# Altium schematic sheet Power Supply.SchDoc (part 3 of 5)
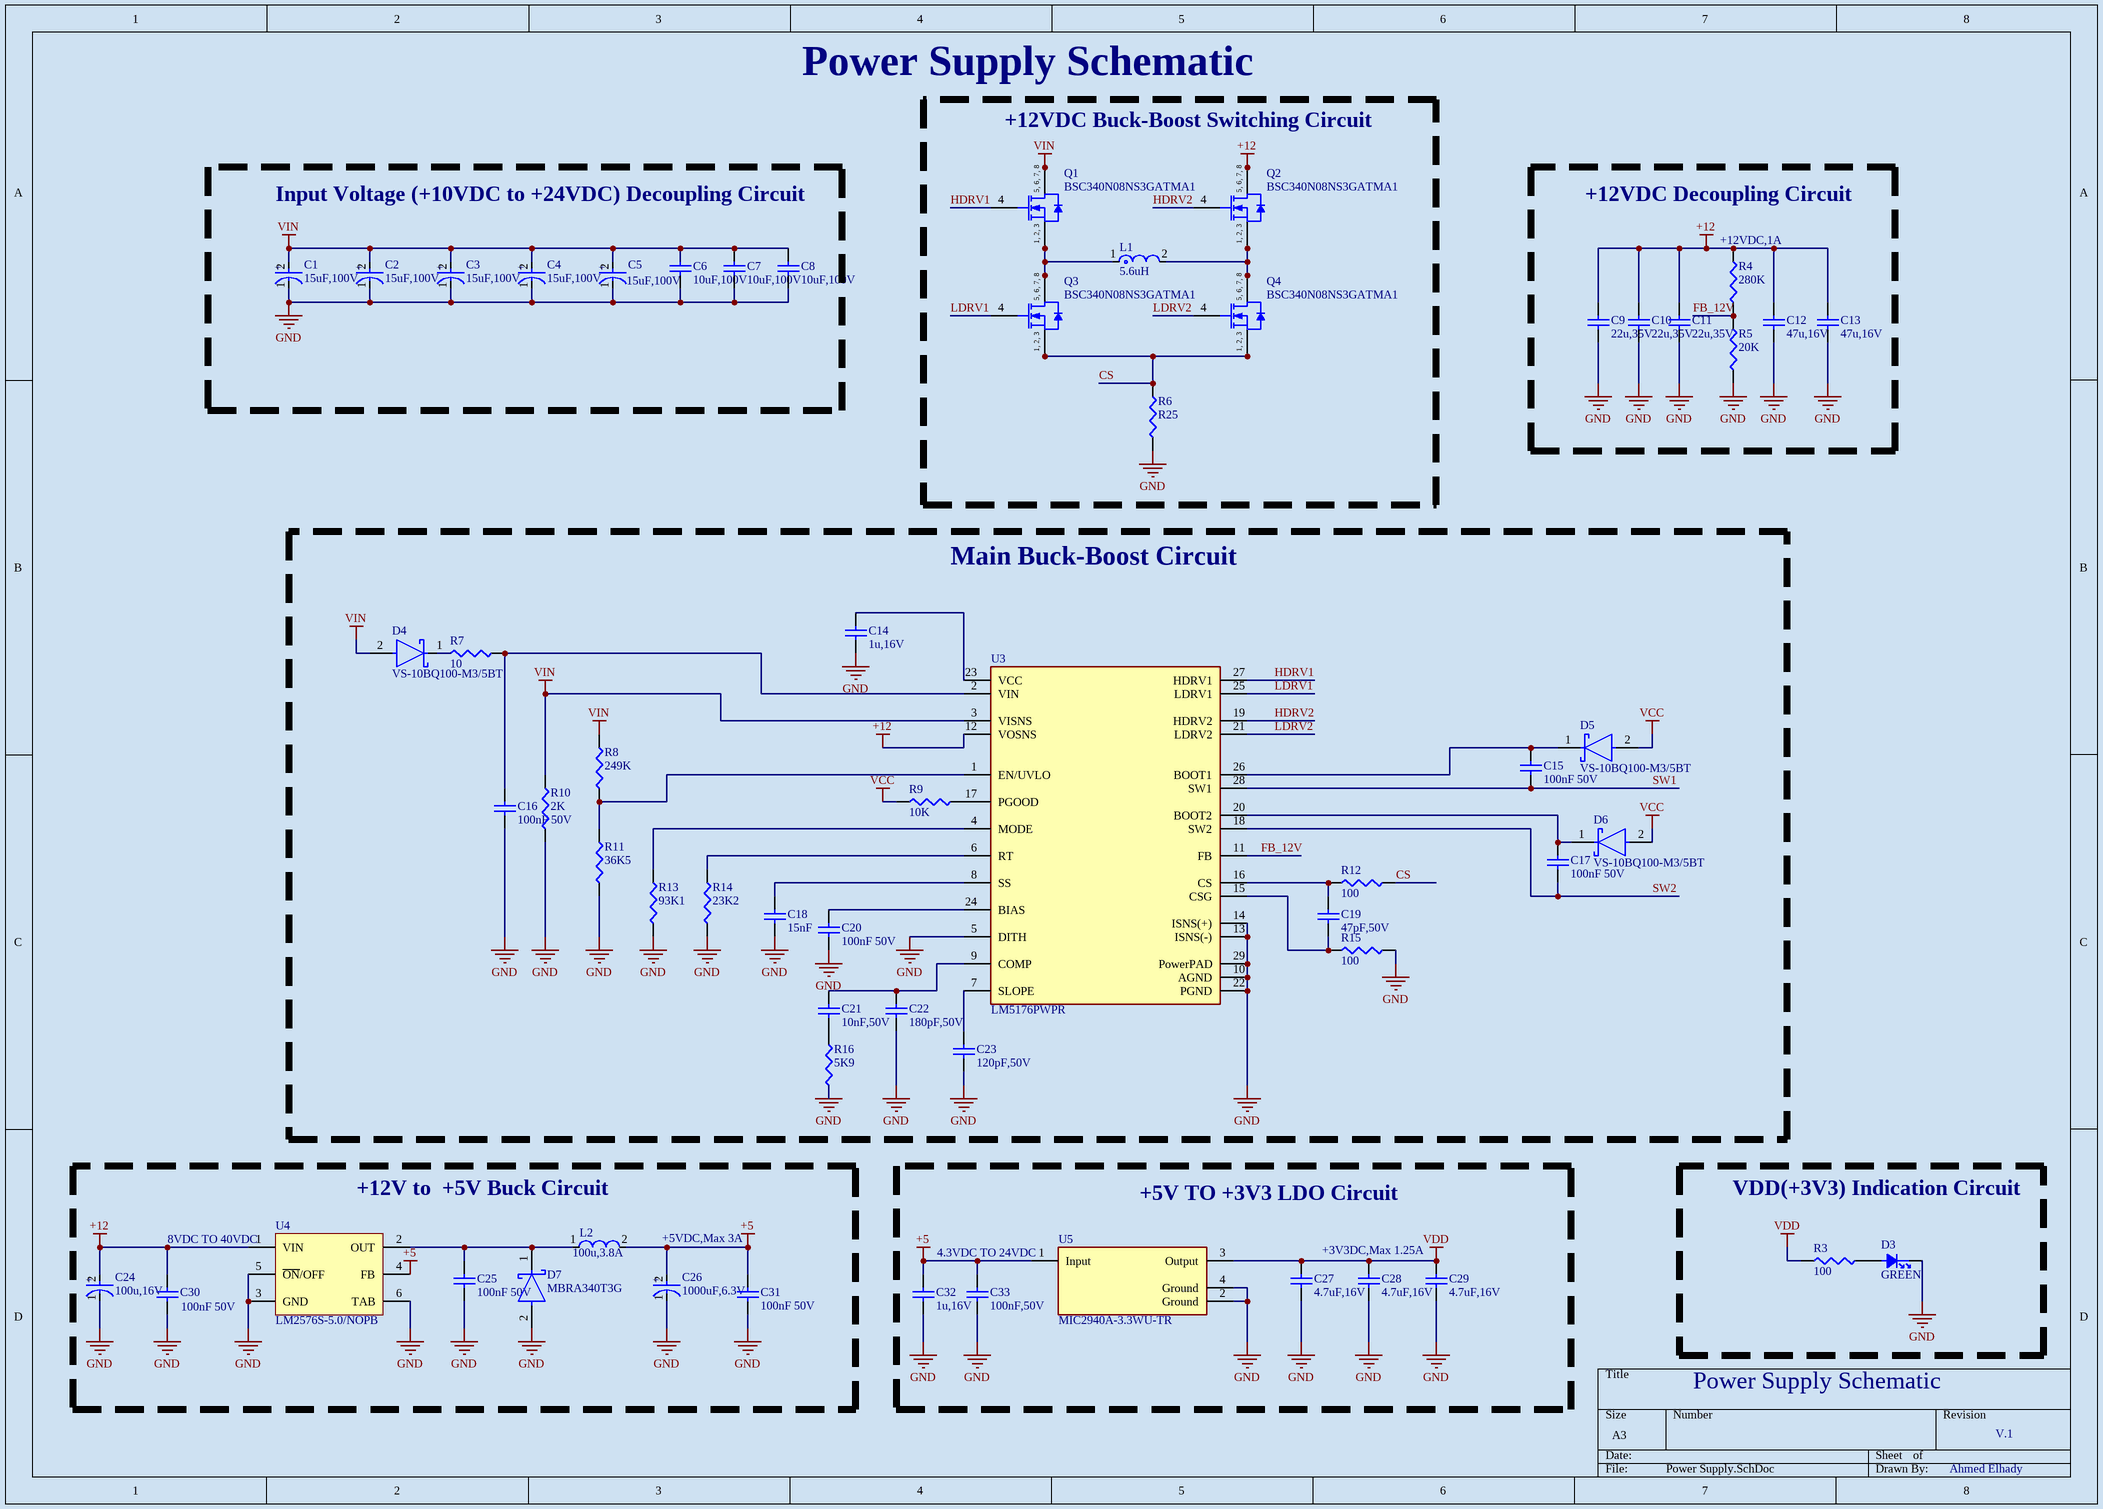
[diagram p2: Power Supply.SchDoc]

## Library data of the parts (continued)
C27-C29 = CL05A475MO5NUNC: 4.7 µF ±20% 16V Ceramic Capacitor X5R 0402 (1005 Metric); Manufacturer: Samsung Electro-Mechanics; Value: 4.7µF; Supplier: DigiKey; Manufacturer Part Number: CL05A475MO5NUNC; RoHS: Compliant; Category: Ceramic Capacitors; Stock: 135039; Pricing: 1=0.12, 10=0.084 (USD); Case/Package: 0402; Case Code (Imperial): 0402; Case Code (Metric): 1005; China RoHS: Compliant; Dielectric: X5R; Dielectric Material: Ceramic; Height: 500µm; Length: 1mm; Lifecycle Status: Production; Material: Ceramic; Max Operating Temperature: 85°C; Min Operating Temperature: -55°C; Mounting Technology: Surface Mount; Number of Terminals: 2; REACH SVHC: Yes; Schedule B: 8532240020, 8532240020|8532240020, 8532240020|8532240020|8532240020, 8532240020|8532240020|8532240020|8532240020; Thickness: 558.8µm; Tolerance: 20%; Voltage Rating: 16V; Voltage Rating (DC): 16V; Width: 500µm; ComponentLink1URL: https://datasheet.octopart.com:443/CL05A475MO5NUNC-Samsung-Electro-Mechanics-datasheet-178175196.pdf?src-supplier=Farnell; ComponentLink1Description: https://datasheet.octopart.com:443/CL05A475MO5NUNC-Samsung-Electro-Mechanics-datasheet-178175196.pdf?src-supplier=Farnell; ComponentLink2URL: https://datasheet.octopart.com:443/CL05A475MO5NUNC-Samsung-Electro-Mechanics-datasheet-123102911.pdf?src-supplier=Future+Electronics; ComponentLink2Description: https://datasheet.octopart.com:443/CL05A475MO5NUNC-Samsung-Electro-Mechanics-datasheet-123102911.pdf?src-supplier=Future+Electronics; ComponentLink3URL: https://datasheet.octopart.com:443/CL05A475MO5NUNC-Samsung-Electro-Mechanics-datasheet-110226225.pdf?src-supplier=Future+Electronics; ComponentLink3Description: https://datasheet.octopart.com:443/CL05A475MO5NUNC-Samsung-Electro-Mechanics-datasheet-110226225.pdf?src-supplier=Future+Electronics; ComponentLink4URL: https://datasheet.octopart.com:443/CL05A475MO5NUNC-Samsung-Electro-Mechanics-datasheet-83567908.pdf?src-supplier=Future+Electronics; ComponentLink4Description: https://datasheet.octopart.com:443/CL05A475MO5NUNC-Samsung-Electro-Mechanics-datasheet-83567908.pdf?src-supplier=Future+Electronics; ComponentLink5URL: https://datasheet.octopart.com:443/CL05A475MO5NUNC-Samsung-Electro-Mechanics-datasheet-68297032.pdf?src-supplier=Future+Electronics; ComponentLink5Description: https://datasheet.octopart.com:443/CL05A475MO5NUNC-Samsung-Electro-Mechanics-datasheet-68297032.pdf?src-supplier=Future+Electronics; ComponentLink6URL: https://datasheet.octopart.com:443/CL05A475MO5NUNC-Samsung-Electro-Mechanics-datasheet-87580057.pdf?src-supplier=Future+Electronics; ComponentLink6Description: https://datasheet.octopart.com:443/CL05A475MO5NUNC-Samsung-Electro-Mechanics-datasheet-87580057.pdf?src-supplier=Future+Electronics; ComponentLink7URL: https://datasheet.octopart.com:443/CL05A475MO5NUNC-Samsung-Electro-Mechanics-datasheet-149136694.pdf?src-supplier=Future+Electronics; ComponentLink7Description: https://datasheet.octopart.com:443/CL05A475MO5NUNC-Samsung-Electro-Mechanics-datasheet-149136694.pdf?src-supplier=Future+Electronics; LCSC Part Number: C318563
D3 = VLMG1500-GS08: Yellow-Green 571nm LED Indication - Discrete 2V 0402 (1005 Metric); Manufacturer: Vishay; Color: Green, Yellow; Forward Current: 30mA; Forward Voltage: 2.4V; Lens Color: Clear; Lens Style: Rectangular; Luminous Intensity: 18mcd; Number of Circuits: 1; Power Dissipation: 75mW; Reverse Voltage: 5V; Test Current: 20mA; Viewing Angle: 130°; Supplier: DigiKey; Manufacturer Part Number: VLMG1500-GS08; RoHS: Compliant; Category: LEDs; Stock: 250894; Pricing: 1=0.24, 10=0.164, 100=0.1147, 500=0.09218, 1000=0.0847 (USD); Ambient Temperature Range High: 85°C; Case/Package: 0402; Case Code (Imperial): 0402; Case Code (Metric): 1005; Depth: 500µm; Dominant Wavelength: 571nm; Height: 350µm; Illumination Color: Green; Lead Free: Lead Free; Length: 1mm; Lifecycle Status: Production; Max Operating Temperature: 85°C; Min Operating Temperature: -30°C; Mounting Technology: Surface Mount; Number of Elements: 1; Number of LEDs: 1; Pins: 2; Number of Terminals: 2; Packaging: Cut Tape; Peak Wavelength: 571nm; Power Rating: 75mW; Radiation Hardening: No; REACH SVHC: Yes; Schedule B: 8541402000, 8541402000|8541402000|8541402000|8541402000|8541402000; Shape: Rectangular; Terminal Pitch: 675µm; Wavelength: 571nm; Width: 500µm; ComponentLink1URL: https://datasheet.octopart.com:443/VLMG1500-GS08-Vishay-datasheet-181477802.pdf?src-supplier=IHS; ComponentLink1Description: https://datasheet.octopart.com:443/VLMG1500-GS08-Vishay-datasheet-181477802.pdf?src-supplier=IHS; ComponentLink2URL: https://datasheet.octopart.com:443/VLMG1500-GS08-Vishay-datasheet-21227148.pdf?src-supplier=element14+APAC; ComponentLink2Description: https://datasheet.octopart.com:443/VLMG1500-GS08-Vishay-datasheet-21227148.pdf?src-supplier=element14+APAC; ComponentLink3URL: https://datasheet.octopart.com:443/VLMG1500-GS08-Vishay-datasheet-33014519.pdf?src-supplier=element14+APAC; ComponentLink3Description: https://datasheet.octopart.com:443/VLMG1500-GS08-Vishay-datasheet-33014519.pdf?src-supplier=element14+APAC; ComponentLink4URL: https://datasheet.octopart.com:443/VLMG1500-GS08-Vishay-datasheet-62332426.pdf?src-supplier=Newark; ComponentLink4Description: https://datasheet.octopart.com:443/VLMG1500-GS08-Vishay-datasheet-62332426.pdf?src-supplier=Newark; ComponentLink5URL: https://datasheet.octopart.com:443/VLMG1500-GS08-Vishay-datasheet-102762782.pdf?src-supplier=Future+Electronics; ComponentLink5Description: https://datasheet.octopart.com:443/VLMG1500-GS08-Vishay-datasheet-102762782.pdf?src-supplier=Future+Electronics; ComponentLink6URL: https://datasheet.octopart.com:443/VLMG1500-GS08-Vishay-datasheet-68326145.pdf?src-supplier=TME; ComponentLink6Description: https://datasheet.octopart.com:443/VLMG1500-GS08-Vishay-datasheet-68326145.pdf?src-supplier=TME; ComponentLink7URL: http://sigma.octopart.com:80/rohs_statement/Vishay-company-15.pdf?src-supplier=Compliance+Statements; ComponentLink7Description: http://sigma.octopart.com:80/rohs_statement/Vishay-company-15.pdf?src-supplier=Compliance+Statements; LCSC Part Number: C511404
D4-D6 = VS-10BQ100-M3/5BT: Rectifier Diode Schottky 100V 1A 2-Pin SMB T/R / DIODE SCHOTTKY 100V 1A SMB; Manufacturer: Vishay; Value: 65pF; Element Configuration: Single; Max Forward Surge Current (Ifsm): 38A; Max Junction Temperature (Tj): 175°C; Number of Elements: 1; Peak Non-Repetitive Surge Current: 780A; Peak Reverse Current: 500µA; Supplier: DigiKey; Manufacturer Part Number: VS-10BQ100-M3/5BT; RoHS: Compliant; Category: Schottky Diodes; Stock: 33815; Pricing: 1=0.38, 10=0.284, 100=0.2258, 500=0.17026, 1000=0.14915 (USD); Average Rectified Current: 1A; Case/Package: SMB; Forward Current: 1A; Height: 2.44mm; Lead Free: Lead Free; Length: 4.7mm; Lifecycle Status: Production; Max Operating Temperature: 175°C; Max Repetitive Reverse Voltage (Vrrm): 100V; Max Reverse Voltage (DC): 100V; Min Operating Temperature: -55°C; Mounting Technology: Surface Mount; Pins: 2; Number of Terminals: 2; REACH SVHC: No; Reverse Standoff Voltage: 100V; Reverse Voltage: 100V; Schedule B: 8541100080, 8541100080|8541100080|8541100080|8541100080|8541100080; Width: 3.8mm; ComponentLink1URL: https://datasheet.octopart.com:443/VS-10BQ100-M3-5BT-Vishay-datasheet-178520333.pdf?src-supplier=Newark; ComponentLink1Description: https://datasheet.octopart.com:443/VS-10BQ100-M3-5BT-Vishay-datasheet-178520333.pdf?src-supplier=Newark; ComponentLink2URL: https://sigma.octopart.com:443/138898532/technical_drawing/Vishay-VS-10BQ100-M3-5BT.pdf?src-supplier=Upverter; ComponentLink2Description: https://sigma.octopart.com:443/138898532/technical_drawing/Vishay-VS-10BQ100-M3-5BT.pdf?src-supplier=Upverter; ComponentLink3URL: https://datasheet.octopart.com:443/VS-10BQ100-M3-5BT-Vishay-datasheet-67698555.pdf?src-supplier=element14+APAC; ComponentLink3Description: https://datasheet.octopart.com:443/VS-10BQ100-M3-5BT-Vishay-datasheet-67698555.pdf?src-supplier=element14+APAC; ComponentLink4URL: https://datasheet.octopart.com:443/VS-10BQ100-M3-5BT-Vishay-datasheet-137894626.pdf?src-supplier=Future+Electronics; ComponentLink4Description: https://datasheet.octopart.com:443/VS-10BQ100-M3-5BT-Vishay-datasheet-137894626.pdf?src-supplier=Future+Electronics; ComponentLink5URL: https://datasheet.octopart.com:443/VS-10BQ100-M3-5BT-Vishay-datasheet-39729334.pdf?src-supplier=Future+Electronics; ComponentLink5Description: https://datasheet.octopart.com:443/VS-10BQ100-M3-5BT-Vishay-datasheet-39729334.pdf?src-supplier=Future+Electronics; ComponentLink6URL: https://datasheet.octopart.com:443/VS-10BQ100-M3-5BT-Vishay-Dale-datasheet-111086972.pdf?src-supplier=RS+(Formerly+Allied+Electronics); ComponentLink6Description: https://datasheet.octopart.com:443/VS-10BQ100-M3-5BT-Vishay-Dale-datasheet-111086972.pdf?src-supplier=RS+(Formerly+Allied+Electronics); ComponentLink7URL: https://datasheet.octopart.com:443/VS-10BQ100-M3-5BT-Vishay-datasheet-42673636.pdf?src-supplier=TME; ComponentLink7Description: https://datasheet.octopart.com:443/VS-10BQ100-M3-5BT-Vishay-datasheet-42673636.pdf?src-supplier=TME; ComponentLink8URL: http://sigma.octopart.com:80/rohs_statement/Vishay-company-15.pdf?src-supplier=Compliance+Statements; ComponentLink8Description: http://sigma.octopart.com:80/rohs_statement/Vishay-company-15.pdf?src-supplier=Compliance+Statements; LCSC PN: C468041
D7 = MBRA340T3G: Diode; Schottky Barrier; Vr 40V; If 3A; Pkg SMA; Vf 0.45V; Tj +150degc; Cs 100A; Ir 15mA; Manufacturer: onsemi; Manufacturer Lifecycle Status: ACTIVE; Element Configuration: Single; Forward Voltage: 450mV; Max Junction Temperature (Tj): 150°C; Number of Elements: 1; Peak Reverse Current: 300µA; Polarity: Standard; Supplier: DigiKey; Manufacturer Part Number: MBRA340T3G; RoHS: Compliant; Category: Schottky Diodes; Stock: 140782; Pricing: 1=0.88, 10=0.548, 100=0.3555, 500=0.2726, 1000=0.24585, 2000=0.22334, 5000=0.19897, 10000=0.1839, 15000=0.17623, 25000=0.168 (USD); Average Rectified Current: 3A; Case/Package: SMA; China RoHS: Non-Compliant; Current Rating: 3A; Forward Current: 3A; Halogen Free: Halogen Free; Height: 2.2mm; Lead Free: Lead Free; Length: 4.32mm; Lifecycle Status: Production; Max Forward Surge Current (Ifsm): 100A; Max Operating Temperature: 150°C; Max Output current: 3A; Max Repetitive Reverse Voltage (Vrrm): 40V; Max Reverse Voltage (DC): 40V; Min Operating Temperature: -55°C; Pins: 2; Number of Terminals: 2; Output Current: 3A; Packaging: Tape and Reel; Peak Non-Repetitive Surge Current: 100A; Radiation Hardening: No; REACH SVHC: No; Reverse Standoff Voltage: 40V; Reverse Voltage: 40V; Schedule B: 8541100080; Voltage Rating (DC): 40V; Width: 2.6mm; ComponentLink1URL: https://datasheet.octopart.com:443/MBRA340T3G-ON-Semiconductor-datasheet-623523.pdf?src-supplier=Master+Electronics; ComponentLink1Description: https://datasheet.octopart.com:443/MBRA340T3G-ON-Semiconductor-datasheet-623523.pdf?src-supplier=Master+Electronics; ComponentLink2URL: https://datasheet.octopart.com:443/MBRA340T3G-ON-Semiconductor-datasheet-141916657.pdf?src-supplier=Upverter; ComponentLink2Description: https://datasheet.octopart.com:443/MBRA340T3G-ON-Semiconductor-datasheet-141916657.pdf?src-supplier=Upverter; ComponentLink3URL: https://datasheet.octopart.com:443/MBRA340T3G-onsemi-datasheet-180961701.pdf?src-supplier=IHS; ComponentLink3Description: https://datasheet.octopart.com:443/MBRA340T3G-onsemi-datasheet-180961701.pdf?src-supplier=IHS; ComponentLink4URL: https://datasheet.octopart.com:443/MBRA340T3G-ON-Semiconductor-datasheet-139011791.pdf?src-supplier=onsemi; ComponentLink4Description: https://datasheet.octopart.com:443/MBRA340T3G-ON-Semiconductor-datasheet-139011791.pdf?src-supplier=onsemi; ComponentLink5URL: https://datasheet.octopart.com:443/MBRA340T3G-ON-Semiconductor-datasheet-21210960.pdf?src-supplier=Newark; ComponentLink5Description: https://datasheet.octopart.com:443/MBRA340T3G-ON-Semiconductor-datasheet-21210960.pdf?src-supplier=Newark; ComponentLink6URL: https://datasheet.octopart.com:443/MBRA340T3G-ON-Semiconductor-datasheet-11724913.pdf?src-supplier=Newark; ComponentLink6Description: https://datasheet.octopart.com:443/MBRA340T3G-ON-Semiconductor-datasheet-11724913.pdf?src-supplier=Newark; ComponentLink7URL: https://datasheet.octopart.com:443/MBRA340T3G.-onsemi-datasheet-184397938.pdf?src-supplier=Newark; ComponentLink7Description: https://datasheet.octopart.com:443/MBRA340T3G.-onsemi-datasheet-184397938.pdf?src-supplier=Newark; ComponentLink8URL: https://datasheet.octopart.com:443/MBRA340T3G-onsemi-datasheet-180967052.pdf?src-supplier=Farnell; ComponentLink8Description: https://datasheet.octopart.com:443/MBRA340T3G-onsemi-datasheet-180967052.pdf?src-supplier=Farnell; ComponentLink9URL: https://datasheet.octopart.com:443/MBRA340T3G-ON-Semiconductor-datasheet-7627526.pdf?src-supplier=Farnell; ComponentLink9Description: https://datasheet.octopart.com:443/MBRA340T3G-ON-Semiconductor-datasheet-7627526.pdf?src-supplier=Farnell; ComponentLink10URL: https://datasheet.octopart.com:443/MBRA340T3G-ON-Semiconductor-datasheet-14054808.pdf?src-supplier=iiiC; ComponentLink10Description: https://datasheet.octopart.com:443/MBRA340T3G-ON-Semiconductor-datasheet-14054808.pdf?src-supplier=iiiC; ComponentLink11URL: https://datasheet.octopart.com:443/MBRA340T3G-ON-Semiconductor-datasheet-9706899.pdf?src-supplier=RS+(Formerly+Allied+Electronics); ComponentLink11Description: https://datasheet.octopart.com:443/MBRA340T3G-ON-Semiconductor-datasheet-9706899.pdf?src-supplier=RS+(Formerly+Allied+Electronics); ComponentLink12URL: http://sigma.octopart.com:80/15540786/rohs_certificate/ON-Semiconductor-MBRA340T3G.pdf?src-supplier=Compliance+Statements; ComponentLink12Description: http://sigma.octopart.com:80/15540786/rohs_certificate/ON-Semiconductor-MBRA340T3G.pdf?src-supplier=Compliance+Statements; ComponentLink13URL: http://sigma.octopart.com:80/15677621/materials_sheet/ON-Semiconductor-MBRA340T3G.csv?src-supplier=Compliance+Statements; ComponentLink13Description: http://sigma.octopart.com:80/15677621/materials_sheet/ON-Semiconductor-MBRA340T3G.csv?src-supplier=Compliance+Statements; ComponentLink14URL: http://sigma.octopart.com:80/150614152/rohs_statement/ON-Semiconductor-MBRA340T3G.pdf?src-supplier=Compliance+Statements; ComponentLink14Description: http://sigma.octopart.com:80/150614152/rohs_statement/ON-Semiconductor-MBRA340T3G.pdf?src-supplier=Compliance+Statements; ComponentLink15URL: http://sigma.octopart.com:80/reach_statement/ON-Semiconductor-company-79.pdf?src-supplier=Compliance+Statements; ComponentLink15Description: http://sigma.octopart.com:80/reach_statement/ON-Semiconductor-company-79.pdf?src-supplier=Compliance+Statements; ComponentLink16URL: https://octopart.com:443/opatz8j6/c1?t=zzn-QeKWnUTIoInBBQPnq2-KsBHceJK6K3Di68oXKNRROh1yObwrhIfgiObG-wqoALwLVjTjSHmYplZjCeWn-q8HVpW_q2F8JFKJqslmK1ptKZFGgWhiNTjCk-X3F1oiCxuNacxFjO0GuM-e28TQqjTQ5gDglIyA9DiWDXs9_UD5t2jlYsyT0X_N6D3As7ewWxw82up4uMZrz57LDgjWgjShyOLNEPJgVYRYhs_nhtEi-aeewe94t8zG-fVSA0SK1baPOhdicFNVV1nRPYknrO_IJ2AVTt3JuNz5Rux_5Ji3UfZsPwlPyX2eF8yjwkYgfgWinTURtYyAI9fkAiCLBUZamGpUFuLxlfvL&src-supplier=Compliance+Statements; ComponentLink16Description: https://octopart.com:443/opatz8j6/c1?t=zzn-QeKWnUTIoInBBQPnq2-KsBHceJK6K3Di68oXKNRROh1yObwrhIfgiObG-wqoALwLVjTjSHmYplZjCeWn-q8HVpW_q2F8JFKJqslmK1ptKZFGgWhiNTjCk-X3F1oiCxuNacxFjO0GuM-e28TQqjTQ5gDglIyA9DiWDXs9_UD5t2jlYsyT0X_N6D3As7ewWxw82up4uMZrz57LDgjWgjShyOLNEPJgVYRYhs_nhtEi-aeewe94t8zG-fVSA0SK1baPOhdicFNVV1nRPYknrO_IJ2AVTt3JuNz5Rux_5Ji3UfZsPwlPyX2eF8yjwkYgfgWinTURtYyAI9fkAiCLBUZamGpUFuLxlfvL&src-supplier=Compliance+Statements; ComponentLink17URL: https://octopart.com:443/opatz8j6/c1?t=NJ8a6hvi7xfiMo7vANJq_qq5CwgiSOMZ50FoGwFbdVP4ZYU8l2yzsihL5d3PYwPSnveb6yOwPbFEklAt98_r0GPlS3SH0en-PzaQ4UJ87X-8SUKCS_jgwdOPTTlwC48N3JBxqteYaPYTYi_MWY_tr-8i0sZ6qVdPF2LoDUWuM_HCXvNlLxr-CuaxZkYPpSF7SojnQnnv5iJsrRNMU3w9C2QjPL7Dn52RqoX7ulzDwYIbX4FC71ya5r_8oyAS221O1yOsg23BvQOD9XPEKD_2ywml0mHj-wzm5xxtgYeWvmyBCaeMd406MBzdLevzYMOAcnTG_zam_3et1Hn15cynFImq-tcBB7RajZQ4FQ&src-supplier=Compliance+Statements; ComponentLink17Description: https://octopart.com:443/opatz8j6/c1?t=NJ8a6hvi7xfiMo7vANJq_qq5CwgiSOMZ50FoGwFbdVP4ZYU8l2yzsihL5d3PYwPSnveb6yOwPbFEklAt98_r0GPlS3SH0en-PzaQ4UJ87X-8SUKCS_jgwdOPTTlwC48N3JBxqteYaPYTYi_MWY_tr-8i0sZ6qVdPF2LoDUWuM_HCXvNlLxr-CuaxZkYPpSF7SojnQnnv5iJsrRNMU3w9C2QjPL7Dn52RqoX7ulzDwYIbX4FC71ya5r_8oyAS221O1yOsg23BvQOD9XPEKD_2ywml0mHj-wzm5xxtgYeWvmyBCaeMd406MBzdLevzYMOAcnTG_zam_3et1Hn15cynFImq-tcBB7RajZQ4FQ&src-supplier=Compliance+Statements; LCSC PN: C26178
L1 = XAL5050-562MEC: 5.6 µH Shielded Molded Inductor 7.2 A 25.8mOhm Max Nonstandard; Manufacturer: Coilcraft; Core Material: Composite; DC Resistance (DCR): 25.8mΩ; Value: 5.6µH; Max Current Rating: 7.2A; Number of Circuits: 1; Self Resonant Frequency: 25MHz; Shielding: Yes; Test Frequency: 1MHz; Tolerance: 20%; Supplier: DigiKey Marketplace; Manufacturer Part Number: XAL5050-562MEC; RoHS: Compliant; Category: Fixed Inductors; Stock: 4733; Pricing: 1=4.11, 100=3.6, 250=2.715, 500=1.635 (USD); Height: 5.1mm; Lead Free: Contains Lead; Length: 5.68mm; Lifecycle Status: Production; Max DC Current: 7.2A; Max Operating Temperature: 125°C; Min Operating Temperature: -40°C; Number of Terminals: 2; REACH SVHC: Yes; Termination: SMD/SMT; Width: 5.28mm; ComponentLink1URL: https://datasheet.octopart.com:443/XAL5050-562MEC-Coilcraft-datasheet-180122023.pdf?src-supplier=IHS; ComponentLink1Description: https://datasheet.octopart.com:443/XAL5050-562MEC-Coilcraft-datasheet-180122023.pdf?src-supplier=IHS; ComponentLink2URL: https://datasheet.octopart.com:443/XAL5050-562MEC-Coilcraft-datasheet-10792017.pdf?src-supplier=Coilcraft+Direct; ComponentLink2Description: https://datasheet.octopart.com:443/XAL5050-562MEC-Coilcraft-datasheet-10792017.pdf?src-supplier=Coilcraft+Direct; LCSC PN: C7305309
L2 = AMDLA1306Q-101MT: 100 µH Shielded Molded Inductor 3.8 A 161mOhm Max Nonstandard; Manufacturer: Abracon; DC Resistance (DCR): 161mΩ; Value: 100µH; Number of Circuits: 1; Shielding: Yes; Test Frequency: 100kHz; Tolerance: 20%; Supplier: DigiKey; Manufacturer Part Number: AMDLA1306Q-101MT; RoHS: Compliant; Category: Fixed Inductors; Pricing: 500=0.69478 (USD); Height: 6.2mm; Lifecycle Status: Production; Max Current Rating: 3.8A; Max Operating Temperature: 155°C; Min Operating Temperature: -55°C; Number of Terminals: 2; REACH SVHC: Yes; Width: 12.6mm; ComponentLink1URL: https://datasheet.octopart.com:443/AMDLA1306Q-101MT-Abracon-datasheet-182205435.pdf?src-supplier=IHS; ComponentLink1Description: https://datasheet.octopart.com:443/AMDLA1306Q-101MT-Abracon-datasheet-182205435.pdf?src-supplier=IHS; ComponentLink2URL: http://sigma.octopart.com:80/conflict_mineral_statement/Abracon-company-27.pdf?src-supplier=Compliance+Statements; ComponentLink2Description: http://sigma.octopart.com:80/conflict_mineral_statement/Abracon-company-27.pdf?src-supplier=Compliance+Statements; LCSC PN: C1016338
Q1-Q4 = BSC340N08NS3GATMA1: N-Channel 80 V 7A (Ta), 23A (Tc) 2.5W (Ta), 32W (Tc) Surface Mount PG-TDSON-8-5; Manufacturer: Infineon; Drain to Source Resistance: 34mΩ; Drain to Source Voltage (Vdss): 80V; Fall Time: 2ns; Gate to Source Voltage (Vgs): 20V; Input Capacitance: 564pF; Number of Elements: 1; Rise Time: 3ns; Turn-Off Delay Time: 11ns; Turn-On Delay Time: 8ns; Supplier: DigiKey; Manufacturer Part Number: BSC340N08NS3GATMA1; RoHS: Compliant; Category: MOSFETs; Stock: 65358; Pricing: 1=0.78, 10=0.632, 100=0.4682, 500=0.41688, 1000=0.35938, 2000=0.34976 (USD); China RoHS: Compliant; Continuous Drain Current (ID): 7A; Halogen Free: Halogen Free; Lead Free: Contains Lead; Lifecycle Status: Production; Max Dual Supply Voltage: 80V; Max Operating Temperature: 150°C; Max Power Dissipation: 32W; Min Breakdown Voltage: 80V; Min Operating Temperature: -55°C; Mounting Technology: Surface Mount; Pins: 8; Number of Terminals: 8; On-State Resistance: 34mΩ; Package Quantity: 5000; Packaging: Tape & Reel; Power Dissipation: 32W; Radiation Hardening: No; Rds On Max: 34mΩ; REACH SVHC: No; Schedule B: 8541290080, 8541290080|8541290080|8541290080|8541290080|8541290080; ComponentLink1URL: https://datasheet.octopart.com:443/BSC340N08NS3GATMA1-Infineon-datasheet-11791424.pdf?src-supplier=IHS; ComponentLink1Description: https://datasheet.octopart.com:443/BSC340N08NS3GATMA1-Infineon-datasheet-11791424.pdf?src-supplier=IHS; ComponentLink2URL: https://datasheet.octopart.com:443/BSC340N08NS3-G-Infineon-datasheet-10738940.pdf?src-supplier=iiiC; ComponentLink2Description: https://datasheet.octopart.com:443/BSC340N08NS3-G-Infineon-datasheet-10738940.pdf?src-supplier=iiiC; ComponentLink3URL: http://sigma.octopart.com:80/conflict_mineral_statement/Infineon-company-51.pdf?src-supplier=Compliance+Statements; ComponentLink3Description: http://sigma.octopart.com:80/conflict_mineral_statement/Infineon-company-51.pdf?src-supplier=Compliance+Statements; LCSC PN: C83511
R3 R12 R15 = CRCW0603100RFKEA: 100 Ohms ±1% 0.125W, 1/8W Chip Resistor 0603 (1608 Metric) Automotive AEC-Q200 Thick Film; Manufacturer: Vishay; Max Power Dissipation: 100mW; Value: 100Ω; Temperature Coefficient: 100ppm/°C; Voltage Rating: 75V; Supplier: DigiKey; Manufacturer Part Number: CRCW0603100RFKEA; RoHS: Compliant; Category: Chip SMD Resistors; Stock: 486492; Pricing: 1=0.1, 10=0.03, 25=0.0224, 50=0.0182, 100=0.015, 250=0.01172, 500=0.0099, 1000=0.00845 (USD); Case/Package: 0603; Case Code (Imperial): 0603; China RoHS: Non-Compliant; Composition: Thick Film; Contact Plating: Tin; Depth: 850µm; Features: Automotive AEC-Q200; Height: 450µm; Lead Free: Lead Free; Length: 1.55mm; Lifecycle Status: Production; Max Operating Temperature: 155°C; Military Standard: Not; Min Operating Temperature: -55°C; Mounting Technology: Surface Mount; Pins: 2; Number of Terminals: 2; Number of Terminations: 2; Packaging: Cut Tape; Power Dissipation: 100mW; Power Rating: 100mW; Radiation Hardening: No; REACH SVHC: Yes; Schedule B: 8533210045; Termination: SMD/SMT; Tolerance: 1%; Voltage Rating (DC): 75V; Weight: 2.012816mg; Width: 850µm; Working Voltage: 75V; ComponentLink1URL: https://datasheet.octopart.com:443/CRCW0603100RFKEA-Vishay-datasheet-175423584.pdf?src-supplier=Newark; ComponentLink1Description: https://datasheet.octopart.com:443/CRCW0603100RFKEA-Vishay-datasheet-175423584.pdf?src-supplier=Newark; ComponentLink2URL: https://datasheet.octopart.com:443/CRCW0603100RFKEA-Vishay-datasheet-14722531.pdf?src-supplier=Newark; ComponentLink2Description: https://datasheet.octopart.com:443/CRCW0603100RFKEA-Vishay-datasheet-14722531.pdf?src-supplier=Newark; ComponentLink3URL: https://datasheet.octopart.com:443/CRCW0603100RFKEA-Vishay-datasheet-11516975.pdf?src-supplier=Newark; ComponentLink3Description: https://datasheet.octopart.com:443/CRCW0603100RFKEA-Vishay-datasheet-11516975.pdf?src-supplier=Newark; ComponentLink4URL: https://datasheet.octopart.com:443/CRCW0603100RFKEA-Vishay-datasheet-41302739.pdf?src-supplier=Newark; ComponentLink4Description: https://datasheet.octopart.com:443/CRCW0603100RFKEA-Vishay-datasheet-41302739.pdf?src-supplier=Newark; ComponentLink5URL: https://datasheet.octopart.com:443/CRCW0603100RFKEA-Vishay-datasheet-33013972.pdf?src-supplier=Newark; ComponentLink5Description: https://datasheet.octopart.com:443/CRCW0603100RFKEA-Vishay-datasheet-33013972.pdf?src-supplier=Newark; ComponentLink6URL: https://datasheet.octopart.com:443/CRCW0603100RFKEA-Vishay-datasheet-21226360.pdf?src-supplier=Newark; ComponentLink6Description: https://datasheet.octopart.com:443/CRCW0603100RFKEA-Vishay-datasheet-21226360.pdf?src-supplier=Newark; ComponentLink7URL: https://datasheet.octopart.com:443/CRCW0603100RFKEA-Vishay-datasheet-62316122.pdf?src-supplier=Future+Electronics; ComponentLink7Description: https://datasheet.octopart.com:443/CRCW0603100RFKEA-Vishay-datasheet-62316122.pdf?src-supplier=Future+Electronics; ComponentLink8URL: https://datasheet.octopart.com:443/CRCW0603100RFKEA-Vishay-datasheet-5300368.pdf?src-supplier=Future+Electronics; ComponentLink8Description: https://datasheet.octopart.com:443/CRCW0603100RFKEA-Vishay-datasheet-5300368.pdf?src-supplier=Future+Electronics; ComponentLink9URL: https://datasheet.octopart.com:443/CRCW0603100RFKEA-Vishay-datasheet-83961561.pdf?src-supplier=element14+APAC; ComponentLink9Description: https://datasheet.octopart.com:443/CRCW0603100RFKEA-Vishay-datasheet-83961561.pdf?src-supplier=element14+APAC; ComponentLink10URL: https://datasheet.octopart.com:443/CRCW0603100RFKEA-Vishay-datasheet-62317933.pdf?src-supplier=element14+APAC; ComponentLink10Description: https://datasheet.octopart.com:443/CRCW0603100RFKEA-Vishay-datasheet-62317933.pdf?src-supplier=element14+APAC; ComponentLink11URL: https://datasheet.octopart.com:443/CRCW0603100RFKEA-Vishay-datasheet-16179825.pdf?src-supplier=element14+APAC; ComponentLink11Description: https://datasheet.octopart.com:443/CRCW0603100RFKEA-Vishay-datasheet-16179825.pdf?src-supplier=element14+APAC; ComponentLink12URL: https://datasheet.octopart.com:443/CRCW0603100RFKEA-Vishay-datasheet-66077789.pdf?src-supplier=element14+APAC; ComponentLink12Description: https://datasheet.octopart.com:443/CRCW0603100RFKEA-Vishay-datasheet-66077789.pdf?src-supplier=element14+APAC; ComponentLink13URL: https://datasheet.octopart.com:443/CRCW0603100RFKEA-Vishay-datasheet-5306405.pdf?src-supplier=RS+(Formerly+Allied+Electronics); ComponentLink13Description: https://datasheet.octopart.com:443/CRCW0603100RFKEA-Vishay-datasheet-5306405.pdf?src-supplier=RS+(Formerly+Allied+Electronics); ComponentLink14URL: https://datasheet.octopart.com:443/CRCW0603100RFKEA-Vishay-Dale-datasheet-47688880.pdf?src-supplier=RS+(Formerly+Allied+Electronics); ComponentLink14Description: https://datasheet.octopart.com:443/CRCW0603100RFKEA-Vishay-Dale-datasheet-47688880.pdf?src-supplier=RS+(Formerly+Allied+Electronics); ComponentLink15URL: https://datasheet.octopart.com:443/CRCW0603100RFKEA-Vishay-datasheet-12001583.pdf?src-supplier=RS+(Formerly+Allied+Electronics); ComponentLink15Description: https://datasheet.octopart.com:443/CRCW0603100RFKEA-Vishay-datasheet-12001583.pdf?src-supplier=RS+(Formerly+Allied+Electronics); ComponentLink16URL: https://datasheet.octopart.com:443/CRCW0603100RFKEA-Vishay-datasheet-137113732.pdf?src-supplier=X-ON; ComponentLink16Description: https://datasheet.octopart.com:443/CRCW0603100RFKEA-Vishay-datasheet-137113732.pdf?src-supplier=X-ON; ComponentLink17URL: https://datasheet.octopart.com:443/CRCW0603100RFKEA-Vishay-datasheet-17834126.pdf?src-supplier=TME; ComponentLink17Description: https://datasheet.octopart.com:443/CRCW0603100RFKEA-Vishay-datasheet-17834126.pdf?src-supplier=TME; ComponentLink18URL: https://datasheet.octopart.com/D-CRCW-e3-Standard-Thick-Film-Chip-Resistors-Vishay-datasheet-family-64.pdf; ComponentLink18Description: https://datasheet.octopart.com/D-CRCW-e3-Standard-Thick-Film-Chip-Resistors-Vishay-datasheet-family-64.pdf; ComponentLink19URL: https://datasheet.octopart.com:443/CRCW0603100RFKEA-Vishay-datasheet-13242068.pdf?src-supplier=Farnell; ComponentLink19Description: https://datasheet.octopart.com:443/CRCW0603100RFKEA-Vishay-datasheet-13242068.pdf?src-supplier=Farnell; ComponentLink20URL: https://datasheet.octopart.com:443/CRCW0603100RFKEA-Vishay-datasheet-13195083.pdf?src-supplier=Farnell; ComponentLink20Description: https://datasheet.octopart.com:443/CRCW0603100RFKEA-Vishay-datasheet-13195083.pdf?src-supplier=Farnell; ComponentLink21URL: https://datasheet.octopart.com:443/CRCW0603100RFKEA-Vishay-datasheet-13034211.pdf?src-supplier=Farnell; ComponentLink21Description: https://datasheet.octopart.com:443/CRCW0603100RFKEA-Vishay-datasheet-13034211.pdf?src-supplier=Farnell; ComponentLink22URL: https://datasheet.octopart.com:443/CRCW0603100RFKEA-Vishay-datasheet-12600034.pdf?src-supplier=Farnell; ComponentLink22Description: https://datasheet.octopart.com:443/CRCW0603100RFKEA-Vishay-datasheet-12600034.pdf?src-supplier=Farnell; ComponentLink23URL: https://datasheet.octopart.com:443/CRCW0603100RFKEA-Vishay-datasheet-12532161.pdf?src-supplier=Farnell; ComponentLink23Description: https://datasheet.octopart.com:443/CRCW0603100RFKEA-Vishay-datasheet-12532161.pdf?src-supplier=Farnell; ComponentLink24URL: https://datasheet.octopart.com:443/CRCW0603100RFKEA-Vishay-datasheet-12517896.pdf?src-supplier=Farnell; ComponentLink24Description: https://datasheet.octopart.com:443/CRCW0603100RFKEA-Vishay-datasheet-12517896.pdf?src-supplier=Farnell; ComponentLink25URL: https://datasheet.octopart.com:443/CRCW0603100RFKEA-Vishay-datasheet-12509762.pdf?src-supplier=Farnell; ComponentLink25Description: https://datasheet.octopart.com:443/CRCW0603100RFKEA-Vishay-datasheet-12509762.pdf?src-supplier=Farnell; ComponentLink26URL: https://datasheet.octopart.com:443/CRCW0603100RFKEA-Vishay-datasheet-10322335.pdf?src-supplier=Farnell; ComponentLink26Description: https://datasheet.octopart.com:443/CRCW0603100RFKEA-Vishay-datasheet-10322335.pdf?src-supplier=Farnell; ComponentLink27URL: https://datasheet.octopart.com:443/CRCW0603100RFKEA-Vishay-datasheet-8788789.pdf?src-supplier=Farnell; ComponentLink27Description: https://datasheet.octopart.com:443/CRCW0603100RFKEA-Vishay-datasheet-8788789.pdf?src-supplier=Farnell; ComponentLink28URL: https://datasheet.octopart.com:443/CRCW0603100RFKEA-Vishay-datasheet-8361388.pdf?src-supplier=Farnell; ComponentLink28Description: https://datasheet.octopart.com:443/CRCW0603100RFKEA-Vishay-datasheet-8361388.pdf?src-supplier=Farnell; ComponentLink29URL: https://datasheet.octopart.com:443/CRCW0603100RFKEA-Vishay-datasheet-546287.pdf?src-supplier=Farnell; ComponentLink29Description: https://datasheet.octopart.com:443/CRCW0603100RFKEA-Vishay-datasheet-546287.pdf?src-supplier=Farnell; ComponentLink30URL: https://datasheet.octopart.com:443/CRCW0603100RFKEA-Vishay-datasheet-11540273.pdf?src-supplier=Arrow+Electronics; ComponentLink30Description: https://datasheet.octopart.com:443/CRCW0603100RFKEA-Vishay-datasheet-11540273.pdf?src-supplier=Arrow+Electronics; ComponentLink31URL: https://datasheet.octopart.com:443/CRCW0603100RFKEA-Vishay-datasheet-8445837.pdf?src-supplier=element14; ComponentLink31Description: https://datasheet.octopart.com:443/CRCW0603100RFKEA-Vishay-datasheet-8445837.pdf?src-supplier=element14; ComponentLink32URL: https://datasheet.octopart.com:443/CRCW0603100RFKEA-Vishay-datasheet-5377433.pdf?src-supplier=Garrett; ComponentLink32Description: https://datasheet.octopart.com:443/CRCW0603100RFKEA-Vishay-datasheet-5377433.pdf?src-supplier=Garrett; ComponentLink33URL: https://datasheet.octopart.com:443/CRCW0603100RFKEA-Vishay-datasheet-148188.pdf?src-supplier=Garrett; ComponentLink33Description: https://datasheet.octopart.com:443/CRCW0603100RFKEA-Vishay-datasheet-148188.pdf?src-supplier=Garrett; ComponentLink34URL: https://datasheet.octopart.com:443/CRCW0603100RFKEA-Vishay-datasheet-30224.pdf?src-supplier=Garrett; ComponentLink34Description: https://datasheet.octopart.com:443/CRCW0603100RFKEA-Vishay-datasheet-30224.pdf?src-supplier=Garrett; ComponentLink35URL: http://sigma.octopart.com:80/rohs_certificate/D-CRCW-e3-Standard-Thick-Film-Chip-Resistors-Vishay-family-102.pdf?src-supplier=Compliance+Statements; ComponentLink35Description: http://sigma.octopart.com:80/rohs_certificate/D-CRCW-e3-Standard-Thick-Film-Chip-Resistors-Vishay-family-102.pdf?src-supplier=Compliance+Statements; LCSC PN: C844917
R4 = CRCW0603280KFKEA: 280 kOhms ±1% 0.125W, 1/8W Chip Resistor 0603 (1608 Metric) Automotive AEC-Q200 Thick Film; Manufacturer: Vishay; Max Power Dissipation: 100mW; Value: 280kΩ; Temperature Coefficient: 100ppm/°C; Voltage Rating: 75V; Supplier: DigiKey; Manufacturer Part Number: CRCW0603280KFKEA; RoHS: Compliant; Category: Chip SMD Resistors; Pricing: 1=0.1, 10=0.03, 25=0.0224, 50=0.0182, 100=0.015, 250=0.01172, 500=0.0099, 1000=0.00845 (USD); Case/Package: 0603; Case Code (Imperial): 0603; China RoHS: Non-Compliant; Composition: Thick Film; Contact Plating: Tin; Depth: 850µm; Features: Automotive AEC-Q200; Height: 450µm; Lead Free: Lead Free; Length: 1.55mm; Lifecycle Status: Production; Max Operating Temperature: 155°C; Military Standard: Not; Min Operating Temperature: -55°C; Mounting Technology: Surface Mount; Pins: 2; Number of Terminals: 2; Number of Terminations: 2; Packaging: Cut Tape; Power Dissipation: 100mW; Power Rating: 100mW; Radiation Hardening: No; REACH SVHC: Yes; Schedule B: 8533210045, 8533210045|8533210045|8533210045|8533210045|8533210045|8533210045|8533210045|8533210045|8533210045|8533210045|8533210045|8533210045|8533210045|8533210045|8533210045|8533210045|8533210045|8533210045|8533210045|8533210045|8533210045|8533210045|8533210045|85; Termination: SMD/SMT; Tolerance: 1%; Voltage Rating (DC): 75V; Weight: 2.012816mg; Width: 850µm; Working Voltage: 75V; ComponentLink1URL: https://datasheet.octopart.com:443/CRCW0603280KFKEA-Vishay-datasheet-175423584.pdf?src-supplier=IHS; ComponentLink1Description: https://datasheet.octopart.com:443/CRCW0603280KFKEA-Vishay-datasheet-175423584.pdf?src-supplier=IHS; ComponentLink2URL: https://datasheet.octopart.com:443/CRCW0603280KFKEA-Vishay-datasheet-62316122.pdf?src-supplier=Future+Electronics; ComponentLink2Description: https://datasheet.octopart.com:443/CRCW0603280KFKEA-Vishay-datasheet-62316122.pdf?src-supplier=Future+Electronics; ComponentLink3URL: https://datasheet.octopart.com:443/CRCW0603280KFKEA-Vishay-datasheet-12519820.pdf?src-supplier=Future+Electronics; ComponentLink3Description: https://datasheet.octopart.com:443/CRCW0603280KFKEA-Vishay-datasheet-12519820.pdf?src-supplier=Future+Electronics; ComponentLink4URL: https://datasheet.octopart.com:443/CRCW0603280KFKEA-Vishay-datasheet-190005712.pdf?src-supplier=TME; ComponentLink4Description: https://datasheet.octopart.com:443/CRCW0603280KFKEA-Vishay-datasheet-190005712.pdf?src-supplier=TME; ComponentLink5URL: https://datasheet.octopart.com:443/CRCW0603280KFKEA-Vishay-datasheet-83961561.pdf?src-supplier=Newark; ComponentLink5Description: https://datasheet.octopart.com:443/CRCW0603280KFKEA-Vishay-datasheet-83961561.pdf?src-supplier=Newark; ComponentLink6URL: https://datasheet.octopart.com:443/CRCW0603280KFKEA-Vishay-datasheet-11516975.pdf?src-supplier=Newark; ComponentLink6Description: https://datasheet.octopart.com:443/CRCW0603280KFKEA-Vishay-datasheet-11516975.pdf?src-supplier=Newark; ComponentLink7URL: https://datasheet.octopart.com:443/CRCW0603280KFKEA-Vishay-datasheet-33013972.pdf?src-supplier=Newark; ComponentLink7Description: https://datasheet.octopart.com:443/CRCW0603280KFKEA-Vishay-datasheet-33013972.pdf?src-supplier=Newark; ComponentLink8URL: https://datasheet.octopart.com:443/CRCW0603280KFKEA-Vishay-datasheet-21268114.pdf?src-supplier=Newark; ComponentLink8Description: https://datasheet.octopart.com:443/CRCW0603280KFKEA-Vishay-datasheet-21268114.pdf?src-supplier=Newark; ComponentLink9URL: https://datasheet.octopart.com:443/CRCW0603280KFKEA-Vishay-datasheet-21226360.pdf?src-supplier=Newark; ComponentLink9Description: https://datasheet.octopart.com:443/CRCW0603280KFKEA-Vishay-datasheet-21226360.pdf?src-supplier=Newark; ComponentLink10URL: https://datasheet.octopart.com:443/CRCW0603280KFKEA-Vishay-datasheet-66077789.pdf?src-supplier=element14+APAC; ComponentLink10Description: https://datasheet.octopart.com:443/CRCW0603280KFKEA-Vishay-datasheet-66077789.pdf?src-supplier=element14+APAC; ComponentLink11URL: https://datasheet.octopart.com:443/CRCW0603280KFKEA-Vishay-datasheet-62317936.pdf?src-supplier=element14+APAC; ComponentLink11Description: https://datasheet.octopart.com:443/CRCW0603280KFKEA-Vishay-datasheet-62317936.pdf?src-supplier=element14+APAC; ComponentLink12URL: https://datasheet.octopart.com:443/CRCW0603280KFKEA-Vishay-datasheet-14722531.pdf?src-supplier=element14+APAC; ComponentLink12Description: https://datasheet.octopart.com:443/CRCW0603280KFKEA-Vishay-datasheet-14722531.pdf?src-supplier=element14+APAC; ComponentLink13URL: https://datasheet.octopart.com:443/CRCW0603280KFKEA.-Vishay-datasheet-78776211.pdf?src-supplier=element14+APAC; ComponentLink13Description: https://datasheet.octopart.com:443/CRCW0603280KFKEA.-Vishay-datasheet-78776211.pdf?src-supplier=element14+APAC; ComponentLink14URL: https://datasheet.octopart.com:443/CRCW0603280KFKEA-Vishay-datasheet-5300368.pdf?src-supplier=Farnell; ComponentLink14Description: https://datasheet.octopart.com:443/CRCW0603280KFKEA-Vishay-datasheet-5300368.pdf?src-supplier=Farnell; ComponentLink15URL: https://datasheet.octopart.com:443/CRCW0603280KFKEA-Vishay-datasheet-13242068.pdf?src-supplier=Farnell; ComponentLink15Description: https://datasheet.octopart.com:443/CRCW0603280KFKEA-Vishay-datasheet-13242068.pdf?src-supplier=Farnell; ComponentLink16URL: https://datasheet.octopart.com:443/CRCW0603280KFKEA-Vishay-datasheet-13195083.pdf?src-supplier=Farnell; ComponentLink16Description: https://datasheet.octopart.com:443/CRCW0603280KFKEA-Vishay-datasheet-13195083.pdf?src-supplier=Farnell; ComponentLink17URL: https://datasheet.octopart.com:443/CRCW0603280KFKEA-Vishay-datasheet-13034211.pdf?src-supplier=Farnell; ComponentLink17Description: https://datasheet.octopart.com:443/CRCW0603280KFKEA-Vishay-datasheet-13034211.pdf?src-supplier=Farnell; ComponentLink18URL: https://datasheet.octopart.com:443/CRCW0603280KFKEA-Vishay-datasheet-12600034.pdf?src-supplier=Farnell; ComponentLink18Description: https://datasheet.octopart.com:443/CRCW0603280KFKEA-Vishay-datasheet-12600034.pdf?src-supplier=Farnell; ComponentLink19URL: https://datasheet.octopart.com:443/CRCW0603280KFKEA-Vishay-datasheet-12532161.pdf?src-supplier=Farnell; ComponentLink19Description: https://datasheet.octopart.com:443/CRCW0603280KFKEA-Vishay-datasheet-12532161.pdf?src-supplier=Farnell; ComponentLink20URL: https://datasheet.octopart.com:443/CRCW0603280KFKEA-Vishay-datasheet-12517896.pdf?src-supplier=Farnell; ComponentLink20Description: https://datasheet.octopart.com:443/CRCW0603280KFKEA-Vishay-datasheet-12517896.pdf?src-supplier=Farnell; ComponentLink21URL: https://datasheet.octopart.com:443/CRCW0603280KFKEA-Vishay-datasheet-12509762.pdf?src-supplier=Farnell; ComponentLink21Description: https://datasheet.octopart.com:443/CRCW0603280KFKEA-Vishay-datasheet-12509762.pdf?src-supplier=Farnell; ComponentLink22URL: https://datasheet.octopart.com:443/CRCW0603280KFKEA-Vishay-datasheet-10322335.pdf?src-supplier=Farnell; ComponentLink22Description: https://datasheet.octopart.com:443/CRCW0603280KFKEA-Vishay-datasheet-10322335.pdf?src-supplier=Farnell; ComponentLink23URL: https://datasheet.octopart.com:443/CRCW0603280KFKEA-Vishay-datasheet-8788789.pdf?src-supplier=Farnell; ComponentLink23Description: https://datasheet.octopart.com:443/CRCW0603280KFKEA-Vishay-datasheet-8788789.pdf?src-supplier=Farnell; ComponentLink24URL: https://datasheet.octopart.com:443/CRCW0603280KFKEA-Vishay-datasheet-8361388.pdf?src-supplier=Farnell; ComponentLink24Description: https://datasheet.octopart.com:443/CRCW0603280KFKEA-Vishay-datasheet-8361388.pdf?src-supplier=Farnell; ComponentLink25URL: https://datasheet.octopart.com:443/CRCW0603280KFKEA-Vishay-datasheet-546287.pdf?src-supplier=Farnell; ComponentLink25Description: https://datasheet.octopart.com:443/CRCW0603280KFKEA-Vishay-datasheet-546287.pdf?src-supplier=Farnell; ComponentLink26URL: https://datasheet.octopart.com:443/CRCW0603280KFKEA-Vishay-datasheet-5306405.pdf?src-supplier=RS+(Formerly+Allied+Electronics); ComponentLink26Description: https://datasheet.octopart.com:443/CRCW0603280KFKEA-Vishay-datasheet-5306405.pdf?src-supplier=RS+(Formerly+Allied+Electronics); ComponentLink27URL: https://datasheet.octopart.com:443/CRCW0603280KFKEA-Vishay-Dale-datasheet-47688880.pdf?src-supplier=RS+(Formerly+Allied+Electronics); ComponentLink27Description: https://datasheet.octopart.com:443/CRCW0603280KFKEA-Vishay-Dale-datasheet-47688880.pdf?src-supplier=RS+(Formerly+Allied+Electronics); ComponentLink28URL: https://datasheet.octopart.com:443/CRCW0603280KFKEA-Vishay-datasheet-12001583.pdf?src-supplier=RS+(Formerly+Allied+Electronics); ComponentLink28Description: https://datasheet.octopart.com:443/CRCW0603280KFKEA-Vishay-datasheet-12001583.pdf?src-supplier=RS+(Formerly+Allied+Electronics); ComponentLink29URL: https://datasheet.octopart.com:443/CRCW0603280KFKEA-Vishay-datasheet-11540273.pdf?src-supplier=Arrow+Electronics; ComponentLink29Description: https://datasheet.octopart.com:443/CRCW0603280KFKEA-Vishay-datasheet-11540273.pdf?src-supplier=Arrow+Electronics; ComponentLink30URL: https://datasheet.octopart.com:443/CRCW0603280KFKEA-Vishay-datasheet-8445837.pdf?src-supplier=element14; ComponentLink30Description: https://datasheet.octopart.com:443/CRCW0603280KFKEA-Vishay-datasheet-8445837.pdf?src-supplier=element14; ComponentLink31URL: https://datasheet.octopart.com:443/CRCW0603280KFKEA-Vishay-datasheet-5377433.pdf?src-supplier=Garrett; ComponentLink31Description: https://datasheet.octopart.com:443/CRCW0603280KFKEA-Vishay-datasheet-5377433.pdf?src-supplier=Garrett; ComponentLink32URL: https://datasheet.octopart.com:443/CRCW0603280KFKEA-Vishay-datasheet-148188.pdf?src-supplier=Garrett; ComponentLink32Description: https://datasheet.octopart.com:443/CRCW0603280KFKEA-Vishay-datasheet-148188.pdf?src-supplier=Garrett; ComponentLink33URL: https://datasheet.octopart.com:443/CRCW0603280KFKEA-Vishay-datasheet-30224.pdf?src-supplier=Garrett; ComponentLink33Description: https://datasheet.octopart.com:443/CRCW0603280KFKEA-Vishay-datasheet-30224.pdf?src-supplier=Garrett; ComponentLink34URL: http://sigma.octopart.com:80/rohs_statement/Vishay-company-15.pdf?src-supplier=Compliance+Statements; ComponentLink34Description: http://sigma.octopart.com:80/rohs_statement/Vishay-company-15.pdf?src-supplier=Compliance+Statements; LCSC PN: C2076728
R5 = RC0603FR-0720KL: 20 kOhms ±1% 0.1W, 1/10W Chip Resistor 0603 (1608 Metric) Moisture Resistant Thick Film; Manufacturer: Yageo Group; Max Power Dissipation: 100mW; Value: 20kΩ; Temperature Coefficient: 100ppm/°C; Voltage Rating: 75V; Voltage Rating (DC): 50V; Supplier: DigiKey; Manufacturer Part Number: RC0603FR-0720KL; RoHS: Compliant; Category: Chip SMD Resistors; Stock: 862388; Pricing: 1=0.1, 10=0.010, 25=0.0088, 50=0.0072, 100=0.0051, 5000=0.00306, 10000=0.00204 (USD); Case/Package: 0603; Case Code (Imperial): 0603; China RoHS: Non-Compliant; Composition: Thick Film; Depth: 800µm; Features: Moisture Resistant; Height: 450µm; Lead Free: Lead Free; Lifecycle Status: Production; Max Operating Temperature: 155°C; Military Standard: Not; Min Operating Temperature: -55°C; Mounting Technology: Surface Mount; Pins: 2; Number of Terminals: 2; Number of Terminations: 2; Packaging: Tape & Reel; Power Dissipation: 100mW; Power Rating: 100mW; REACH SVHC: Yes; Schedule B: 8533210045, 8533210045|8533210045|8533210045|8533210045|8533210045|8533210045|8533210045|8533210045|8533210045|8533210045|8533210045|8533210045|8533210045|8533210045, 8533210045|8533210045|8533210045|8533210045|8533210045|8533210045|8533210045|8533210045|8533210045|8533210045|8533210045|8533210045|8533210045|8533210045|8533210045, 8533210045|8533210045|8533210045|8533210045|8533210045|8533210045|8533210045|8533210045|8533210045|8533210045|8533210045|8533210045|8533210045|8533210045|8533210045|8533210045; Termination: SMD/SMT; Tolerance: 1%; Width: 800µm; Working Voltage: 75V; ComponentLink1URL: https://datasheet.octopart.com:443/RC0603FR-0720KL-Yageo-datasheet-175887523.pdf?src-supplier=IHS; ComponentLink1Description: https://datasheet.octopart.com:443/RC0603FR-0720KL-Yageo-datasheet-175887523.pdf?src-supplier=IHS; ComponentLink2URL: https://datasheet.octopart.com:443/RC0603FR-0720KL-Yageo-datasheet-141265859.pdf?src-supplier=Upverter; ComponentLink2Description: https://datasheet.octopart.com:443/RC0603FR-0720KL-Yageo-datasheet-141265859.pdf?src-supplier=Upverter; ComponentLink3URL: https://datasheet.octopart.com:443/RC0603FR-0720KL-Yageo-datasheet-103092701.pdf?src-supplier=Upverter; ComponentLink3Description: https://datasheet.octopart.com:443/RC0603FR-0720KL-Yageo-datasheet-103092701.pdf?src-supplier=Upverter; ComponentLink4URL: https://sigma.octopart.com:443/138820526/technical_drawing/Yageo-RC0603FR-0720KL.pdf?src-supplier=Upverter; ComponentLink4Description: https://sigma.octopart.com:443/138820526/technical_drawing/Yageo-RC0603FR-0720KL.pdf?src-supplier=Upverter; ComponentLink5URL: https://datasheet.octopart.com:443/RC0603FR-0720KL-Yageo-datasheet-8328172.pdf?src-supplier=Burklin+Elektronik; ComponentLink5Description: https://datasheet.octopart.com:443/RC0603FR-0720KL-Yageo-datasheet-8328172.pdf?src-supplier=Burklin+Elektronik; ComponentLink6URL: https://datasheet.octopart.com:443/RC0603FR-0720KL-Yageo-datasheet-34211833.pdf?src-supplier=element14+APAC; ComponentLink6Description: https://datasheet.octopart.com:443/RC0603FR-0720KL-Yageo-datasheet-34211833.pdf?src-supplier=element14+APAC; ComponentLink7URL: https://datasheet.octopart.com:443/RC0603FR-0720KL-Yageo-datasheet-62067350.pdf?src-supplier=Farnell; ComponentLink7Description: https://datasheet.octopart.com:443/RC0603FR-0720KL-Yageo-datasheet-62067350.pdf?src-supplier=Farnell; ComponentLink8URL: https://datasheet.octopart.com:443/RC0603FR-0720KL-Yageo-datasheet-164759695.pdf?src-supplier=Future+Electronics; ComponentLink8Description: https://datasheet.octopart.com:443/RC0603FR-0720KL-Yageo-datasheet-164759695.pdf?src-supplier=Future+Electronics; ComponentLink9URL: https://datasheet.octopart.com:443/RC0603FR-0720KL-Yageo-datasheet-137700087.pdf?src-supplier=Future+Electronics; ComponentLink9Description: https://datasheet.octopart.com:443/RC0603FR-0720KL-Yageo-datasheet-137700087.pdf?src-supplier=Future+Electronics; ComponentLink10URL: https://datasheet.octopart.com:443/RC0603FR-0720KL-Yageo-datasheet-15599030.pdf?src-supplier=Future+Electronics; ComponentLink10Description: https://datasheet.octopart.com:443/RC0603FR-0720KL-Yageo-datasheet-15599030.pdf?src-supplier=Future+Electronics; ComponentLink11URL: https://datasheet.octopart.com:443/RC0603FR-0720KL-Yageo-datasheet-12596169.pdf?src-supplier=Future+Electronics; ComponentLink11Description: https://datasheet.octopart.com:443/RC0603FR-0720KL-Yageo-datasheet-12596169.pdf?src-supplier=Future+Electronics; ComponentLink12URL: https://datasheet.octopart.com:443/RC0603FR-0720KL-Yageo-datasheet-8324193.pdf?src-supplier=Future+Electronics; ComponentLink12Description: https://datasheet.octopart.com:443/RC0603FR-0720KL-Yageo-datasheet-8324193.pdf?src-supplier=Future+Electronics; ComponentLink13URL: https://datasheet.octopart.com:443/RC0603FR-0720KL-Yageo-datasheet-79472498.pdf?src-supplier=Megastar; ComponentLink13Description: https://datasheet.octopart.com:443/RC0603FR-0720KL-Yageo-datasheet-79472498.pdf?src-supplier=Megastar; ComponentLink14URL: https://datasheet.octopart.com/RC0603FR-0720KL-Yageo-datasheet-73766026.pdf; ComponentLink14Description: https://datasheet.octopart.com/RC0603FR-0720KL-Yageo-datasheet-73766026.pdf; ComponentLink15URL: https://datasheet.octopart.com:443/RC0603FR-0720KL-Yageo-datasheet-30459151.pdf?src-supplier=Seeed+Studio; ComponentLink15Description: https://datasheet.octopart.com:443/RC0603FR-0720KL-Yageo-datasheet-30459151.pdf?src-supplier=Seeed+Studio; ComponentLink16URL: https://datasheet.octopart.com:443/RC0603FR-0720KL-Yageo-datasheet-118562.pdf?src-supplier=DigiKey; ComponentLink16Description: https://datasheet.octopart.com:443/RC0603FR-0720KL-Yageo-datasheet-118562.pdf?src-supplier=DigiKey; ComponentLink17URL: http://sigma.octopart.com:80/conflict_mineral_statement/Yageo-company-3.pdf?src-supplier=Compliance+Statements; ComponentLink17Description: http://sigma.octopart.com:80/conflict_mineral_statement/Yageo-company-3.pdf?src-supplier=Compliance+Statements; ComponentLink18URL: http://sigma.octopart.com:80/rohs_statement/Yageo-company-2.pdf?src-supplier=Compliance+Statements; ComponentLink18Description: http://sigma.octopart.com:80/rohs_statement/Yageo-company-2.pdf?src-supplier=Compliance+Statements; LCSC PN: C105575